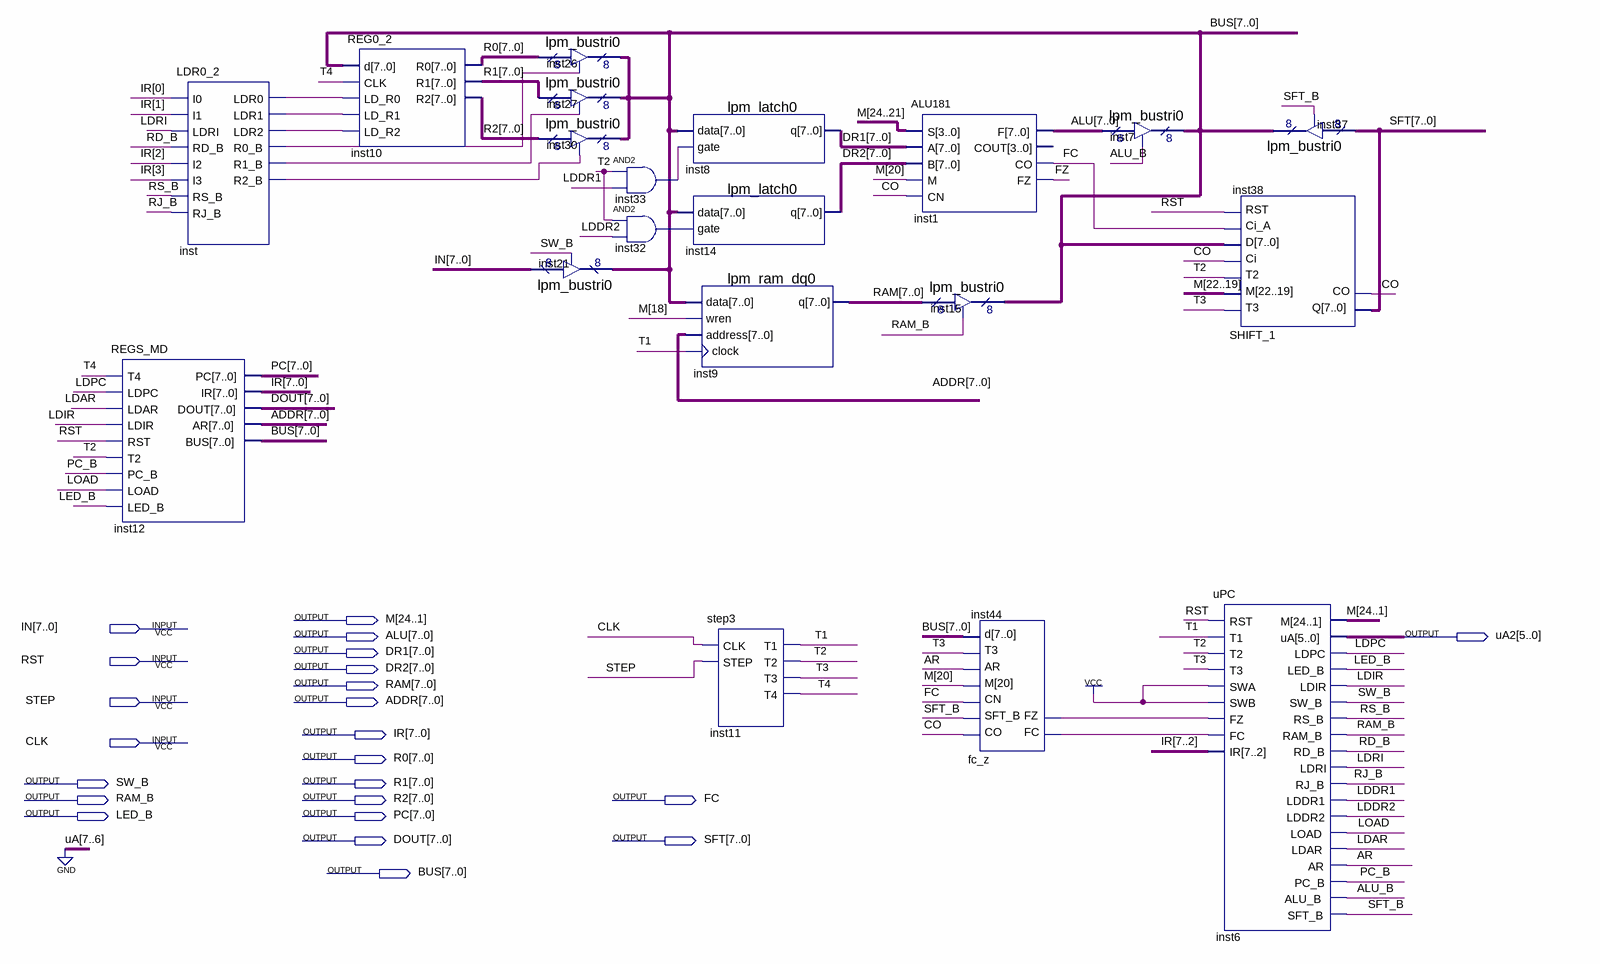
[diagram p0: schematic sheet]
// Quartus schematic CPU8_TEST_1.bdf as structural Verilog: 20 symbols, 23 pins
module CPU8_TEST_1 (
  input  [7:0] IN,
  input  RST,
  input  STEP,
  input  CLK,
  output [24:1] M,
  output [7:0] ALU,
  output [5:0] uA2,
  output [7:0] DR1,
  output [7:0] DR2,
  output [7:0] RAM,
  output [7:0] ADDR,
  output [7:0] IR,
  output [7:0] R0,
  output SW_B,
  output [7:0] R1,
  output RAM_B,
  output [7:0] R2,
  output FC,
  output LED_B,
  output [7:0] PC,
  output [7:0] DOUT,
  output [7:0] SFT,
  output [7:0] BUS
);

  wire ALU_B, AR, CO, FZ, inst32_out, inst33_out, inst44_fc, inst44_fz, inst_ldr0, inst_ldr1, inst_ldr2,
       inst_r0_b, inst_r1_b, inst_r2_b, LDAR, LDDR1, LDDR2, LDIR, LDPC, LDRI, LOAD, PC_B, RD_B, RJ_B, RS_B,
       SFT_B, T1, T2, T3, T4;

  REGS_MD inst12 (
    .T4(T4), .LDPC(LDPC), .LDAR(LDAR), .LDIR(LDIR), .RST(RST), .T2(T2), .PC_B(PC_B), .LOAD(LOAD),
    .LED_B(LED_B), .PC(PC), .IR(IR), .DOUT(DOUT), .AR(ADDR), .BUS(BUS));
  LDR0_2 inst (
    .I0(IR[0]), .I1(IR[1]), .LDRI(LDRI), .RD_B(RD_B), .I2(IR[2]), .I3(IR[3]), .RS_B(RS_B), .RJ_B(RJ_B),
    .LDR0(inst_ldr0), .LDR1(inst_ldr1), .LDR2(inst_ldr2), .R0_B(inst_r0_b), .R1_B(inst_r1_b), .R2_B(inst_r2_b));
  REG0_2 inst10 (.d(BUS), .CLK(T4), .LD_R0(inst_ldr0), .LD_R1(inst_ldr1), .LD_R2(inst_ldr2), .R0(R0), .R1(R1), .R2(R2));
  lpm_bustri0 inst21 (.enabledt(SW_B), .data(IN), .tridata(BUS));
  lpm_bustri0 inst26 (.enabledt(inst_r0_b), .data(R0), .tridata(BUS));
  lpm_bustri0 inst27 (.enabledt(inst_r1_b), .data(R1), .tridata(BUS));
  lpm_bustri0 inst30 (.enabledt(inst_r2_b), .data(R2), .tridata(BUS));
  and inst33 (inst33_out, T2, LDDR1);
  and inst32 (inst32_out, T2, LDDR2);
  lpm_latch0 inst8 (.data(BUS), .gate(inst33_out), .q(DR1));
  lpm_latch0 inst14 (.data(BUS), .gate(inst32_out), .q(DR2));
  lpm_ram_dq0 inst9 (.data(BUS), .wren(M[18]), .address(ADDR), .clock(T1), .q(RAM));
  step3 inst11 (.CLK(CLK), .STEP(STEP), .T1(T1), .T2(T2), .T3(T3), .T4(T4));
  ALU181 inst1 (.S(M[24:21]), .A(DR1), .B(DR2), .M(M[20]), .CN(CO), .F(ALU), .CO(FC), .FZ(FZ));  // open: COUT
  lpm_bustri0 inst15 (.enabledt(RAM_B), .data(RAM), .tridata(BUS));
  fc_z inst44 (.CO(CO), .SFT_B(SFT_B), .CN(FC), .M(M[20]), .AR(AR), .T3(T3), .d(BUS), .FC(inst44_fc), .FZ(inst44_fz));
  lpm_bustri0 inst7 (.enabledt(ALU_B), .data(ALU), .tridata(BUS));
  SHIFT_1 inst38 (.T3(T3), .M(M[22:19]), .T2(T2), .Ci(CO), .D(BUS), .Ci_A(FC), .RST(RST), .Q(SFT), .CO(CO));
  uPC inst6 (
    .RST(RST), .T1(T1), .T2(T2), .T3(T3), .SWA(1'b1), .SWB(1'b1), .FZ(inst44_fz), .FC(inst44_fc),
    .IR(IR[7:2]), .M(M), .uA(uA2), .LDPC(LDPC), .LED_B(LED_B), .LDIR(LDIR), .SW_B(SW_B), .RS_B(RS_B),
    .RAM_B(RAM_B), .RD_B(RD_B), .LDRI(LDRI), .RJ_B(RJ_B), .LDDR1(LDDR1), .LDDR2(LDDR2), .LOAD(LOAD),
    .LDAR(LDAR), .AR(AR), .PC_B(PC_B), .ALU_B(ALU_B), .SFT_B(SFT_B));
  lpm_bustri0 inst37 (.enabledt(SFT_B), .data(SFT), .tridata(BUS));
endmodule
